# EAGLE design Soccer_Robot V1.1L (EAGLE 9.5.1)
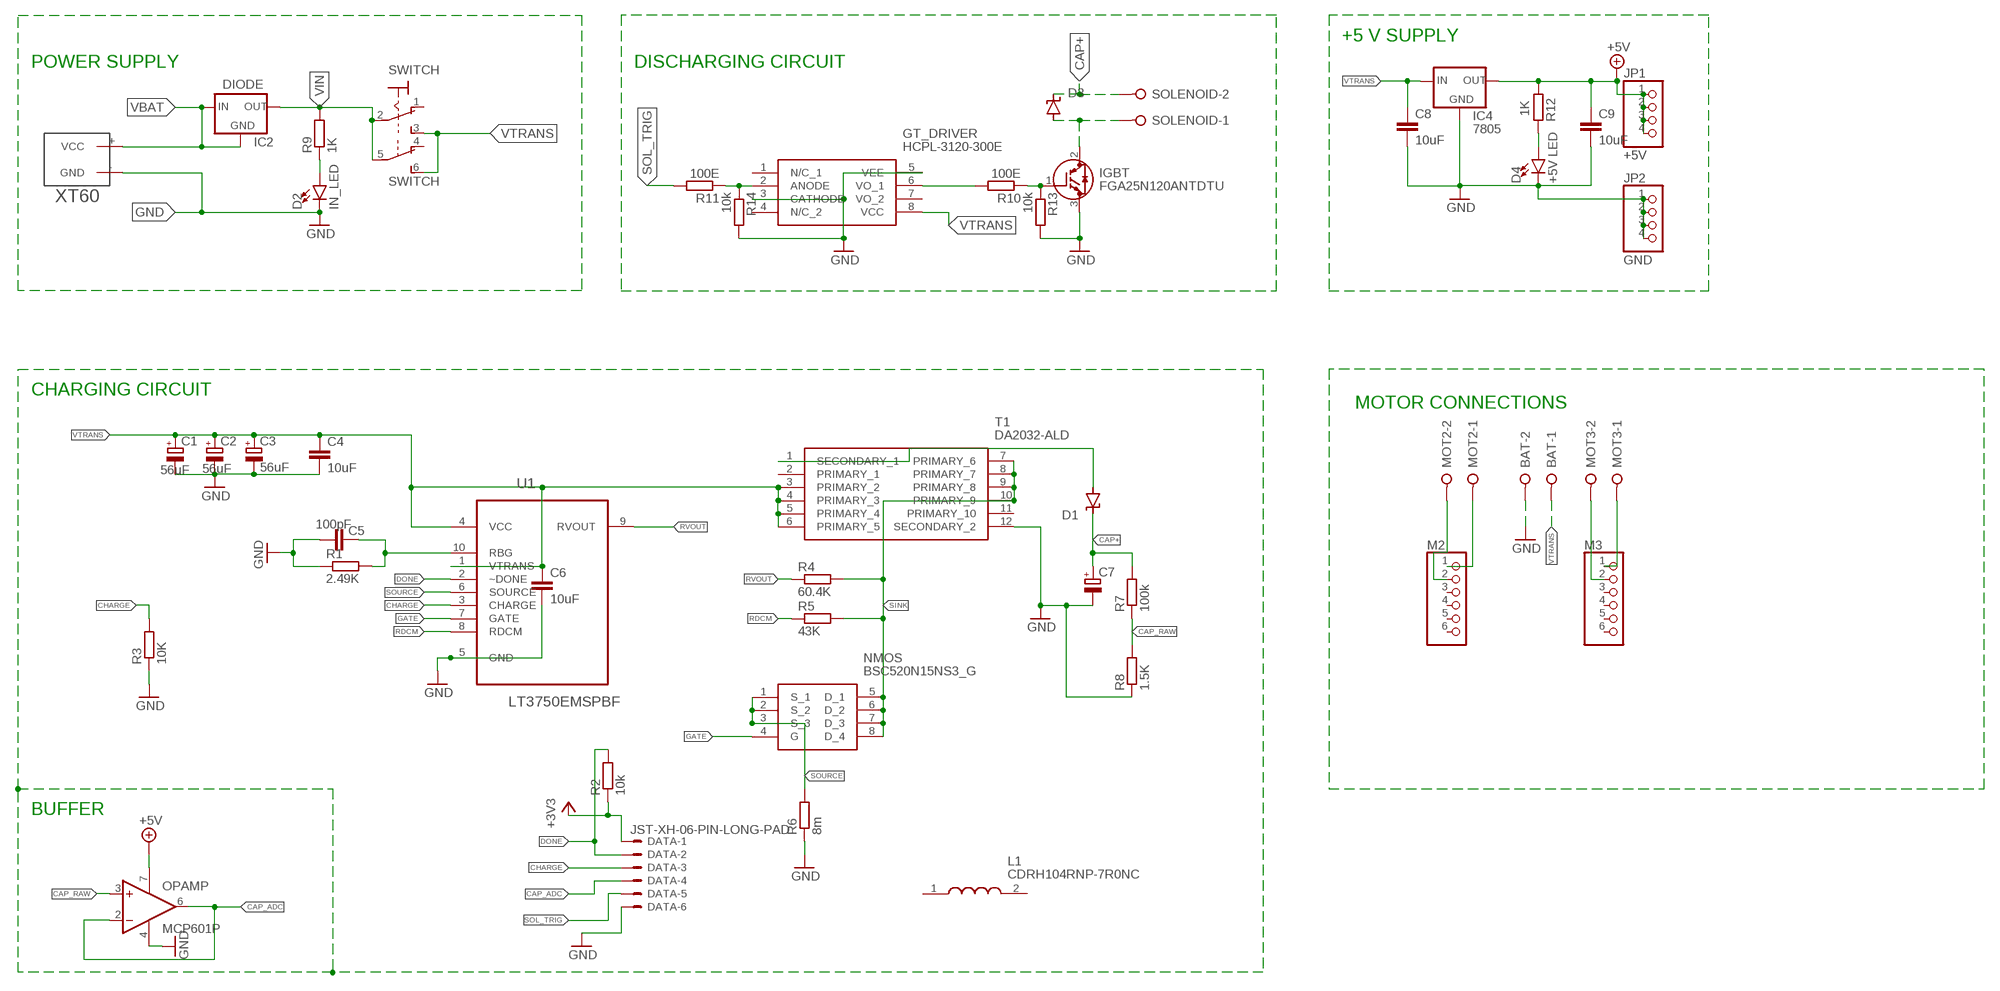
[diagram p0: schematic, sheet 1]

## Parts
BAT  W237-02P  [W237-132]
C1  56uF  CPOL-EUE2.5-5  [E2,5-5]
C2  56uF  CPOL-EUE2.5-5  [E2,5-5]
C3  56uF  CPOL-EUE2.5-5  [E2,5-5]
C4  10uF  C-EUC1206  [C1206]
C5  100pF  C-EUC1206  [C1206]
C6  10uF  C-EUC1206  [C1206]
C7  CPOL-EUE10-30  [EB30D]
C8  10uF  C-EUC1206  [C1206]
C9  10uF  C-EUC1206  [C1206]
D1  SUPPRESSOR-SMBG  [SMBG]
D2  IN_LED  LED5MM  [LED_5MM]
D3  SUPPRESSOR-SMBG  [SMBG]
D4  +5V LED  LED5MM  [LED_5MM]
DATA  JST-XH-06-PIN-LONG-PAD  [JST-XH-06-PACKAGE-LONG-PAD]
GT_DRIVER  HCPL-3120-300E  [HCPL-3120-GULL-WING]
IC2  DIODE  LM1117TO252  [TO252]
IC4  7805  78XXS  [78XXS]
IGBT  FGA25N120ANTDTU  [TO545P500X1560X2420-3P]
JP1  +5V  PINHD-1X4  [1X04]
JP2  GND  PINHD-1X4  [1X04]
L1  CDRH104RNP-7R0NC  [CDRH104RNP7R0NC]
M2  PINHD-1X6  [1X06]
M3  PINHD-1X6  [1X06]
MOT2  W237-02P  [W237-132]
MOT3  W237-02P  [W237-132]
NMOS  BSC520N15NS3_G  [PG-TDSON-8]
OPAMP  MCP601P  [DIL08]
R1  2.49K  R-EU_M1206  [M1206]
R2  10k  R-EU_M1206  [M1206]
R3  10K  R-EU_M1206  [M1206]
R4  60.4K  R-EU_M1206  [M1206]
R5  43K  R-EU_M1206  [M1206]
R6  8m  R-EU_M1206  [M1206]
R7  100k  R-EU_0207/10  [0207/10]
R8  1.5K  R-EU_0207/10  [0207/10]
R9  1K  R-EU_M1206  [M1206]
R10  100E  R-EU_M1206  [M1206]
R11  100E  R-EU_M1206  [M1206]
R12  1K  R-EU_M1206  [M1206]
R13  10k  R-EU_M1206  [M1206]
R14  10k  R-EU_M1206  [M1206]
SOLENOID  W237-02P  [W237-132]
SWITCH  320-938  [320-938]
T1  DA2032-ALD  [SOP250P2197X889-12N]
U1  LT3750EMSPBF  [SOP50P490X110-10N]
U$1  XT60  [XT60]

## Nets
+3V3: DATA.1 R2.1
+5V: C9.1 IC4.OUT JP1.1 JP1.2 JP1.3 JP1.4 OPAMP.7(V+) R12.1
CAP+: C7.+ D1.C D3.C R7.2 SOLENOID.2
CAP_ADC: DATA.4 OPAMP.2(-IN) OPAMP.6(OUT)
CAP_RAW: OPAMP.3(+IN) R7.1 R8.2
CHARGE: DATA.3 R3.2 U1.3(CHARGE)
DONE: DATA.2 R2.2 U1.2(~DONE)
GATE: NMOS.4(G) U1.7(GATE)
GND: BAT.2 C1.- C2.- C3.- C4.2 C5.2 C6.2 C7.- C8.2 C9.2 D2.K(C) D4.K(C) DATA.6 GT_DRIVER.3(CATHODE) GT_DRIVER.5(VEE) IC4.GND IGBT.3(E) JP2.1 JP2.2 JP2.3 JP2.4 OPAMP.4(V-) R1.1 R3.1 R6.1 R8.1 R13.2 R14.2 T1.12(SECONDARY_2) U1.5(GND) U$1.-(GND)
N$2: C5.1 R1.2 U1.10(RBG)
N$4: D1.A T1.1(SECONDARY_1)
N$7: D2.A R9.1
N$8: IGBT.1(G) R10.1 R13.1
N$9: GT_DRIVER.6(VO_1) R10.2
N$10: D3.A IGBT.2(C) SOLENOID.1
N$11: GT_DRIVER.2(ANODE) R11.1 R14.1
N$13: M3.1 MOT3.1
N$14: D4.A R12.2
N$15: M3.2 MOT3.2
N$16: M2.2 MOT2.2
N$17: M2.1 MOT2.1
RDCM: R5.1 U1.8(RDCM)
RVOUT: R4.1 U1.9(RVOUT)
SINK: NMOS.5(D_1) NMOS.6(D_2) NMOS.7(D_3) NMOS.8(D_4) R4.2 R5.2 T1.7(PRIMARY_6) T1.8(PRIMARY_7) T1.9(PRIMARY_8) T1.10(PRIMARY_9)
SOL_TRIG: DATA.5 R11.2
SOURCE: NMOS.1(S_1) NMOS.2(S_2) NMOS.3(S_3) R6.2 U1.6(SOURCE)
VBAT: IC2.1(GND) IC2.2(IN) U$1.+(VCC)
VIN: IC2.3(OUT) R9.2 SWITCH.2(1:P) SWITCH.5(B:P)
VTRANS: BAT.1 C1.+ C2.+ C3.+ C4.1 C6.1 C8.1 GT_DRIVER.8(VCC) IC4.IN SWITCH.3(1:S) SWITCH.6(B:S) T1.3(PRIMARY_2) T1.4(PRIMARY_3) T1.5(PRIMARY_4) T1.6(PRIMARY_5) U1.1(VTRANS) U1.4(VCC)
Unconnected: GT_DRIVER.1(N/C_1) GT_DRIVER.4(N/C_2) GT_DRIVER.7(VO_2) L1.1 L1.2 M2.3 M2.4 M2.5 M2.6 M3.3 M3.4 M3.5 M3.6 SWITCH.1(1:O) SWITCH.4(B:O) T1.2(PRIMARY_1) T1.11(PRIMARY_10)

## Notes on the sheet
- +5 V SUPPLY
- POWER SUPPLY | DISCHARGING CIRCUIT
- CHARGING CIRCUIT
- MOTOR CONNECTIONS
- BUFFER

## Library data of the parts
BAT MOT2 MOT3 SOLENOID = con-wago-508:W237-02P: WAGO SREW CLAMP; OC_FARNELL: unknown; OC_NEWARK: unknown
C1-C3 C7 = rcl:CPOL-EU: POLARIZED CAPACITOR, European symbol; SPICEPREFIX: C
C4-C6 C8 C9 = rcl:C-EU: CAPACITOR, European symbol; SPICEPREFIX: C
D1 D3 = diode:SUPPRESSOR-: Suppressor diode
D2 D4 = SparkFun-LED:LED: LED (Generic) Standard schematic elements and footprints for 5mm, 3mm, 1206, and 0603 sized LEDs. Generic LEDs with no color specified.
DATA = Rembrandt Electronics - JST XH Connectors v1-0:JST-XH-06-PIN: JST XH Connector 2 Pin Wire to board connector. Pitch: 2,54 mm, (0.100") Number of pins: 6 Created by Rembrandt Electronics www.rembrandtelectronics.com
GT_DRIVER = HCPL-3120-300E:HCPL-3120-300E: Logic Output Optocouplers 2.0A IGBT Gate Drive Source: Datasheet; DESCRIPTION: Logic Output Optocouplers 2.0A IGBT Gate Drive; HEIGHT: mm; MANUFACTURER_NAME: Avago Technologies; MANUFACTURER_PART_NUMBER: HCPL-3120-300E; MOUSER_PART_NUMBER: 630-HCPL-3120-300E; MOUSER_PRICE-STOCK: https://www.mouser.com/Search/Refine.aspx?Keyword=630-HCPL-3120-300E
IC2 = v-reg-2:LM1117
IC4 = v-reg-2:78XXS: VOLTAGE REGULATOR
IGBT = FGA25N120ANTDTU:FGA25N120ANTDTU: IGBT N-Ch 1200V 50A NPT Trench TO3PN Fairchild FGA25N120ANTDTU, 50 A 1200 V, 1MHz, 3-Pin TO-3P Source: Datasheet <https://componentsearchengine.com/Datasheets/1/FGA25N120ANTDTU.pdf>; DESCRIPTION: IGBT N-Ch 1200V 50A NPT Trench TO3PN Fairchild FGA25N120ANTDTU, 50 A 1200 V, 1MHz, 3-Pin TO-3P; HEIGHT: 5mm; MANUFACTURER_NAME: ON Semiconductor; MANUFACTURER_PART_NUMBER: FGA25N120ANTDTU; MOUSER_PART_NUMBER: 512-FGA25N120ANTDTU; MOUSER_PRICE-STOCK: https://www.mouser.com/Search/Refine.aspx?Keyword=512-FGA25N120ANTDTU
JP1 JP2 = pinhead:PINHD-1X4: PIN HEADER
L1 = CDRH104RNP-7R0NC:CDRH104RNP-7R0NC: Fixed Inductors 7uH 4.5A Source: Datasheet <https://www.arrow.com/en/products/cdrh104rnp-7r0nc/sumida>; DESCRIPTION: Fixed Inductors 7uH 4.5A; HEIGHT: 4mm; MANUFACTURER_NAME: Sumida; MANUFACTURER_PART_NUMBER: CDRH104RNP-7R0NC; MOUSER_PART_NUMBER: 851-CDRH104RNP-7R0NC; MOUSER_PRICE-STOCK: https://www.mouser.com/Search/Refine.aspx?Keyword=851-CDRH104RNP-7R0NC
M2 M3 = pinhead:PINHD-1X6: PIN HEADER
NMOS = BSC520N15NS3_G:BSC520N15NS3_G: MOSFET N-Ch 150V 21A TDSON-8 OptiMOS 3 Source: Datasheet <https://componentsearchengine.com/Datasheets/1/BSC520N15NS3 G.pdf>; DESCRIPTION: MOSFET N-Ch 150V 21A TDSON-8 OptiMOS 3; HEIGHT: mm; MANUFACTURER_NAME: Infineon; MANUFACTURER_PART_NUMBER: BSC520N15NS3 G; MOUSER_PART_NUMBER: 726-BSC520N15NS3GXT; MOUSER_PRICE-STOCK: https://www.mouser.com/Search/Refine.aspx?Keyword=726-BSC520N15NS3GXT
OPAMP = linear:MCP601: Single Op Amp 2.7V to 6.0V Single Supply CMOS Source: http://ww1.microchip.com/downloads/en/DeviceDoc/21314g.pdf
R1-R14 = rcl:R-EU_: RESISTOR, European symbol; SPICEPREFIX: R
SWITCH = switch:320-938: TOGGLE SWITCH distributor RS Components
T1 = DA2032ALD:DA2032-ALD: COILCRAFT - DA2032-ALD - TRANSFORMER, FLYBACK, LT3750, SMD Source: Datasheet <https://componentsearchengine.com/Datasheets/1/DA2032-ALD.pdf>; DESCRIPTION: COILCRAFT - DA2032-ALD - TRANSFORMER, FLYBACK, LT3750, SMD; HEIGHT: 8.89mm; MANUFACTURER_NAME: COILCRAFT; MANUFACTURER_PART_NUMBER: DA2032-ALD; MOUSER_PART_NUMBER: 994-DA2032-ALD; MOUSER_PRICE-STOCK: https://www.mouser.com/Search/Refine.aspx?Keyword=994-DA2032-ALD
U1 = LT3750-element14:LT3750EMSPBF: Capacitor Charger Controller; MPN: LT3750EMS#PBF; OC_FARNELL: 1273500; OC_NEWARK: 57M8591; PACKAGE: MSOP-10; SUPPLIER: Linear Technology
U$1 = XT60:XT60: XT60

## Board
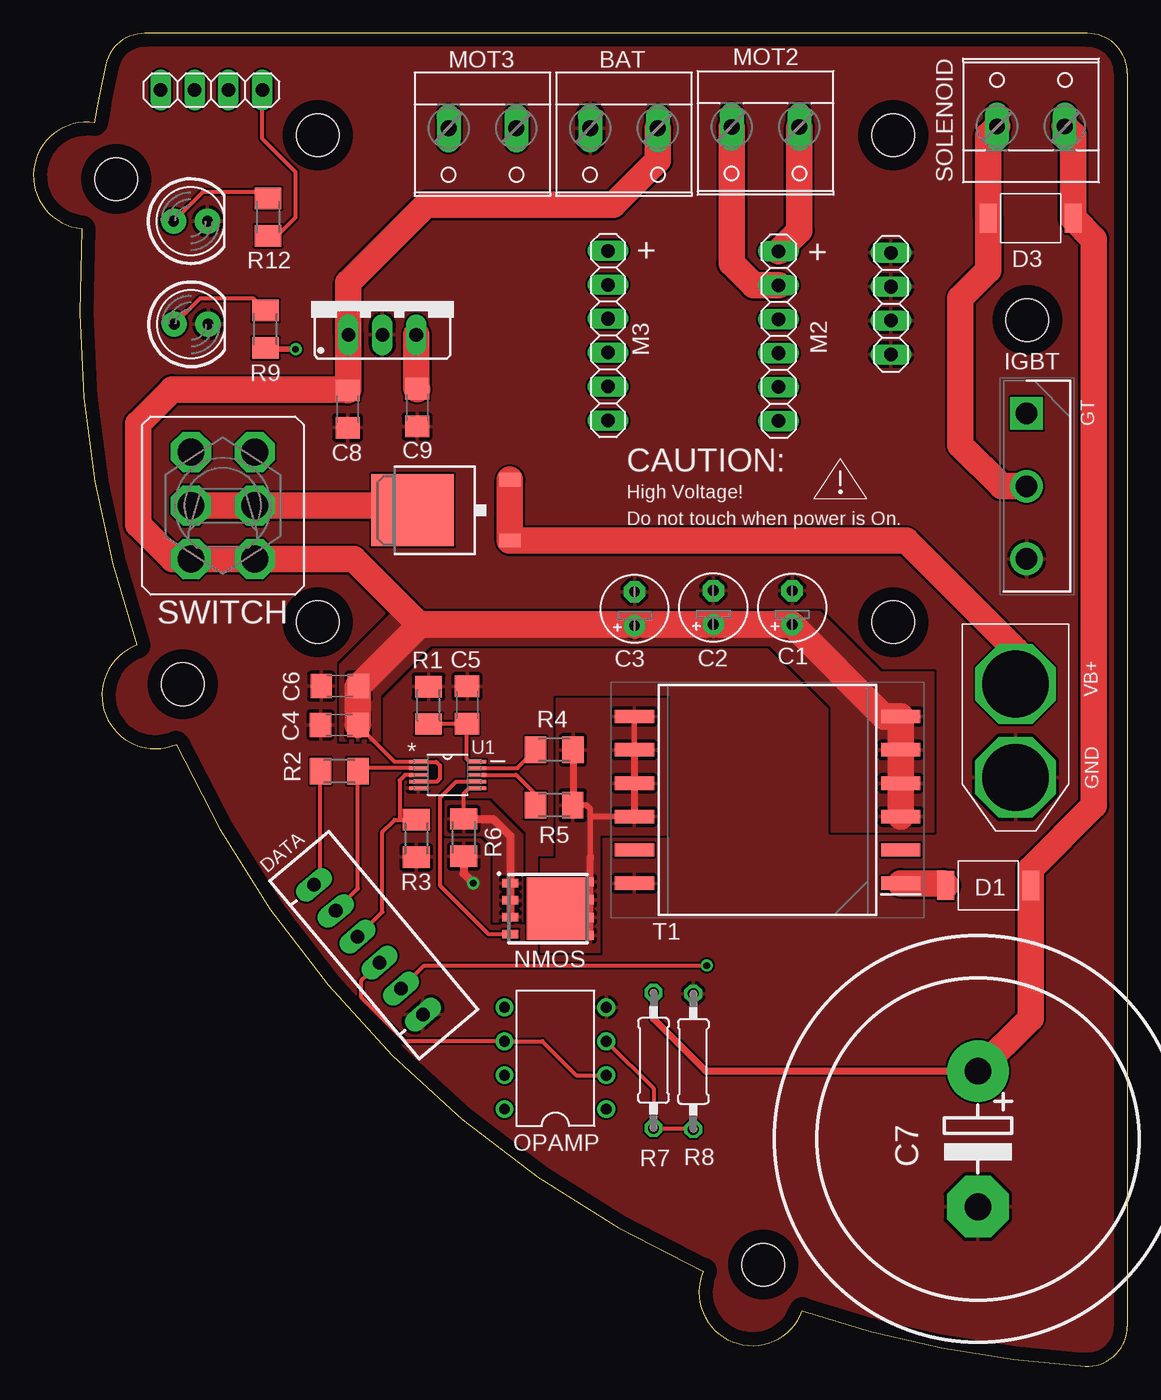
[diagram p1: board, top side]
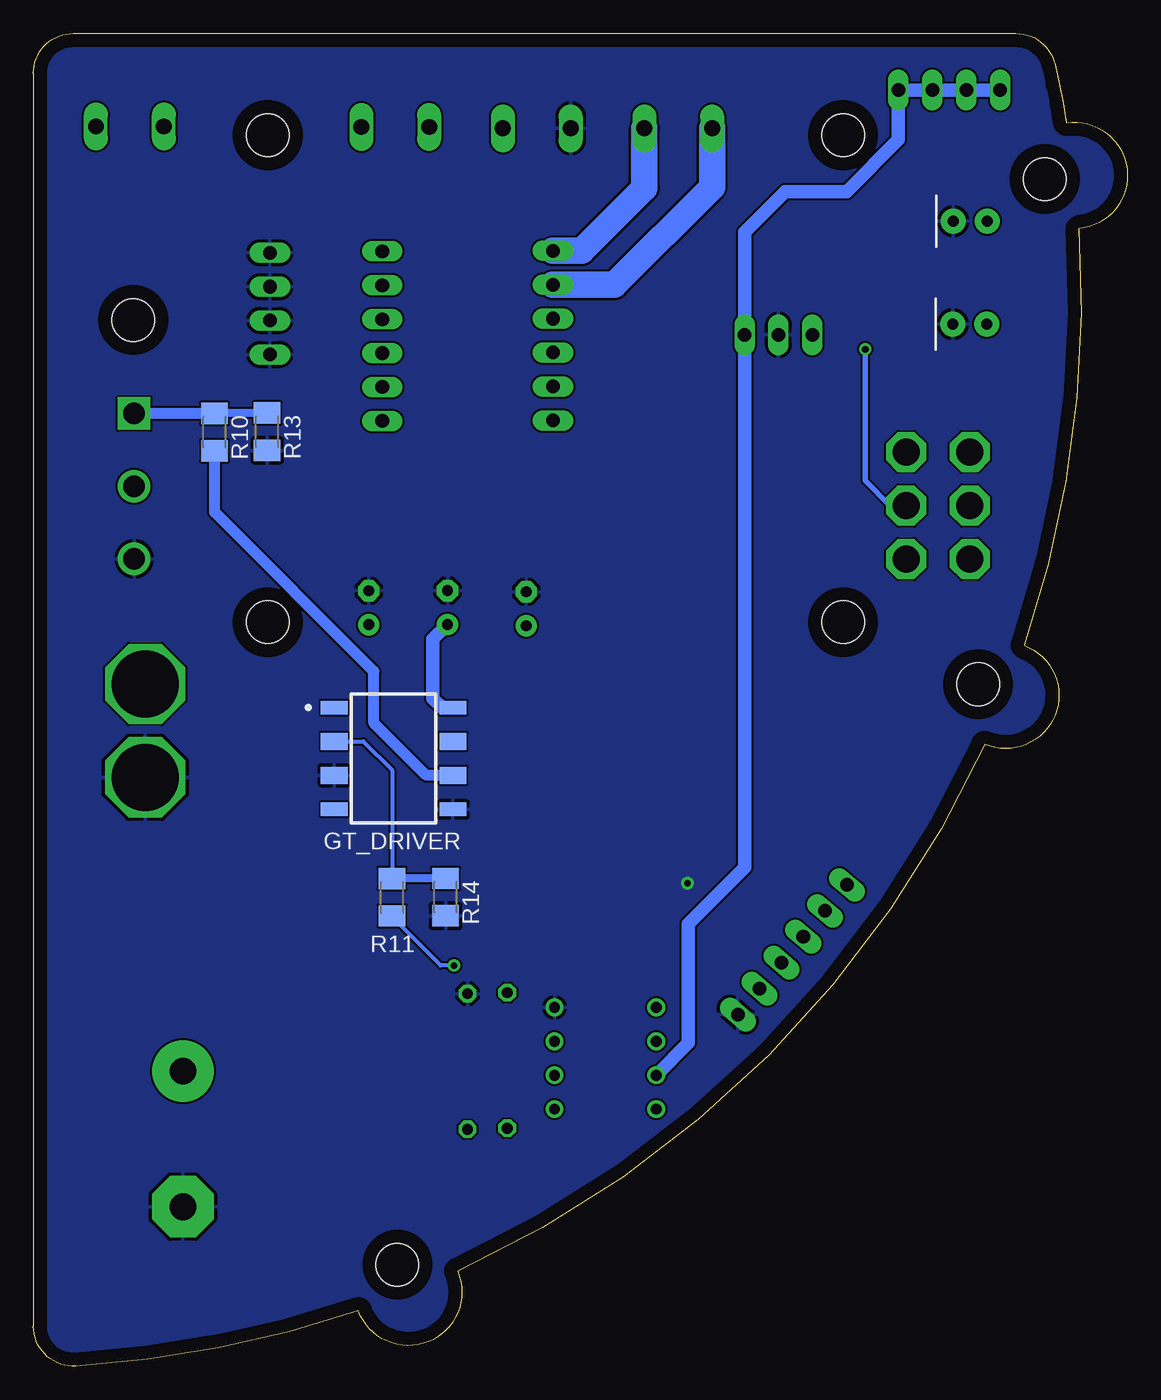
[diagram p2: board, bottom side, seen from below]

Size 81.95 x 99.87 mm. Coordinates in mm from the lower left corner, seen from the top.
Outline: 5.43,97.53 arc3 4.57,93.17 arc183 3.63,85.23 arc23 7.75,54.02 arc183 10.7,46.59 arc41 50.18,7.11 arc183 57.61,4.16 arc15 78.78,0 arc93 81.95,3
Outline: 5.43,97.53 arc-77 8.35,99.87 78.95,99.87 arc-90 81.95,96.87 81.95,4
Outline: 81.95,4.01 81.95,2.98
Copper layers (1*16): Top 0.035mm / dielectric 1.5mm / Bottom 0.035mm
Design rules "default": minimum track width 6mil, minimum drill 0.35mm, track to track 6mil, track to pad 6mil, pad to pad 6mil, via to via 6mil, smd to smd 6mil, copper to edge 40mil, drill to drill 6mil, minimum pad ring 10mil, minimum via ring 8mil, stop-mask expansion 4mil, vias tented up to drill 0mil, thermal gap 10mil
Holes 3.2 mm at 6.21,88.96 54.68,7.61 11.19,51.1 64.4,55.74 74.46,78.39 21.3,92.24 64.4,92.24 21.3,55.74

### Footprints (pad centres in the part's own frame; a part is rotated, then mirrored left to right if it is on the bottom)
W237-132 = drill 1.194 long: 1 -2.54,-0.635; 2 2.54,-0.635
E2,5-5 = drill 0.813 pad 1.6: + -1.27,0 | drill 0.813 pad 1.6 octagon: - 1.27,0
C1206 = smd 1.6 x 1.8: 1 -1.4,0; 2 1.4,0
EB30D = drill 2.007 pad 4.597: + -5.08,0 | drill 2.007 pad 4.597 octagon: - 5.08,0
SMBG = smd 1.27 x 2.16: A 3.17,0; C -3.17,0
LED_5MM = drill 0.813 pad 1.88: A -1.27,0; K 1.27,0
JST-XH-06-PACKAGE-LONG-PAD = drill 1.016 long: 1 -6.35,0; 2 -3.81,0; 3 -1.27,0; 4 1.27,0; 5 3.81,0; 6 6.35,0
HCPL-3120-GULL-WING = smd 1.016 x 2: 1 -3.81,-4.45; 4 3.81,-4.45; 5 3.81,4.45; 8 -3.81,4.45 | smd 1.27 x 2: 2 -1.27,-4.45; 3 1.27,-4.45; 6 1.27,4.45; 7 -1.27,4.45
TO252 = smd 1 x 1.6: 1 -2.28,-6.07; 2 2.28,-6.07 | smd 5.4 x 6.2: 3 0,1.23
78XXS = drill 1.016 long: GND 0,-2.54; IN -2.54,-2.54; OUT 2.54,-2.54
TO545P500X1560X2420-3P = drill 1.62 pad 2.43 square: 1 0,0 | drill 1.62 pad 2.43: 2 5.45,0; 3 10.9,0
1X04 = drill 1.016 long: 1 -3.81,0; 2 -1.27,0; 3 1.27,0; 4 3.81,0
CDRH104RNP7R0NC = smd 3.2 x 1.6: 1 0,-4.45; 2 0,4.45
1X06 = drill 1.016 long: 1 -6.35,0; 2 -3.81,0; 3 -1.27,0; 4 1.27,0; 5 3.81,0; 6 6.35,0
PG-TDSON-8 = smd 0.65 x 1.2: 1 -1.905,-6; 2 -0.635,-6; 3 0.635,-6; 4 1.905,-6 | smd 0.7 x 0.5: 5 2,0; 6 0.665,0; 7 -0.665,0; 8 -2,0 | smd 4.7 x 4.5: 9 0,-2.5
DIL08 = drill 0.813 pad 1.27: 1 -3.81,-3.81; 2 -1.27,-3.81; 3 1.27,-3.81; 4 3.81,-3.81; 5 3.81,3.81; 6 1.27,3.81; 7 -1.27,3.81; 8 -3.81,3.81
M1206 = smd 1.6 x 2: 1 -1.4,0; 2 1.4,0
0207/10 = drill 0.813 octagon: 1 -5.08,0; 2 5.08,0
320-938 = drill 2.007 octagon: 1 -2.388,4.013; 2 -2.388,0; 3 -2.388,-4.013; 4 2.388,4.013; 5 2.388,0; 6 2.388,-4.013
SOP250P2197X889-12N = smd 2.95 x 1: 1 -9.975,6.25; 2 -9.975,3.75; 3 -9.975,1.25; 4 -9.975,-1.25; 5 -9.975,-3.75; 6 -9.975,-6.25; 7 9.975,-6.25; 8 9.975,-3.75; 9 9.975,-1.25; 10 9.975,1.25; 11 9.975,3.75; 12 9.975,6.25
SOP50P490X110-10N = smd 1.397 x 0.279: 1 -2.184,0.991; 2 -2.184,0.508; 3 -2.184,0; 4 -2.184,-0.508; 5 -2.184,-0.991; 6 2.184,-0.991; 7 2.184,-0.508; 8 2.184,0; 9 2.184,0.508; 10 2.184,0.991
XT60 = drill 5 octagon: + 4.5,0; - 11.5,0

### Placement (x,y rotation side)
BAT  44.24,92.12 180 top
C1  56.83,56.83 90 top
C2  50.93,56.84 90 top
C3  45.03,56.75 90 top
C4  22.91,48.06 180 top
C5  32.48,49.54 90 top
C6  22.96,50.96 180 top
C7  70.75,17.03 270 top
C8  23.54,71.72 270 top
C9  28.74,71.82 270 top
D1  71.52,36.02 180 top
D2  11.81,78.07 0 top
D3  74.71,86.02 180 top
D4  11.77,85.8 0 top
DATA  25.1,31.21 310 top
GT_DRIVER  54.97,45.54 270 bottom
IC2  29.62,64.14 90 top
IC4  26.14,79.82 0 top
IGBT  74.4,71.39 270 top
JP1  13.34,95.62 180 top
JP2  64.24,79.62 90 top
L1  -10.56,5.02 0 top  (outside the outline)
M2  55.82,77.18 270 top
M3  43.04,77.22 270 top
MOT2  54.84,92.22 180 top
MOT3  33.64,92.12 180 top
NMOS  41.72,34.28 270 top
OPAMP  39.1,23.07 90 top
R1  29.6,49.52 270 top
R2  22.91,44.57 0 top
R3  28.68,39.54 90 top
R4  39.02,46.18 0 top
R5  39,42.03 0 top
R6  32.23,39.6 90 top
R7  46.45,22.91 90 top
R8  49.43,22.83 270 top
R9  17.38,77.7 270 top
R10  68.38,69.99 270 bottom
R11  55.08,35.14 270 bottom
R12  17.57,86.1 90 top
R13  64.44,70.02 270 bottom
R14  51.08,35.15 270 bottom
SOLENOID  74.72,93.53 0 top
SWITCH  14.19,64.49 0 top
T1  54.99,42.43 180 top
U1  31.02,44.3 0 top
U$1  73.57,55.62 270 top

### Tracks (layer width: path | path; a pad name or v marks a point on that pad's centre or on a via)
+3V3
  Top 0.305: R2.1 21.44,44.5 21.44,36.49 DATA.1
+5V
  Top 0.305: R12.1 18.26,84.7 19.64,86.08 19.64,89.47 17.15,91.96 JP1.1
  Top 0.508: 17.59,84.72 R12.1
  Top 2: IC4.OUT 28.68,73.28 C9.1
  Bottom 0.508: IC4.OUT 28.68,79.78
  Bottom 1.016: JP1.4 JP1.3 JP1.2 JP1.1 17.15,91.91 21.04,88.02 25.63,88.02 28.68,84.97 IC4.OUT 28.68,49.24 28.68,49.23 28.68,37.35 32.88,33.15 32.88,24.21 OPAMP.7
CAP+
  Top 0.508: R7.2 46.45,26.01 50.35,22.11 C7.+
  Top 2: C7.+ 74.69,26.05 D1.C 74.69,37.27 79.44,42.02 79.44,84.46 D3.C 77.88,92.27 SOLENOID.2
CAP_ADC
  Top 0.305: OPAMP.2 40.66,21.8 38.12,24.34 OPAMP.6 27.87,24.34 24.58,27.63 24.58,28.89 25.03,29.35 25.57,29.89 DATA.4
CAP_RAW
  Top 0.305: OPAMP.3 46.45,20.8 R7.1 49.35,17.83 R8.2
CHARGE
  Top 0.305: 27.44,40.94 R3.2 | U1.3 27.85,44.3 27.44,43.89 27.44,40.94 | 27.44,40.94 27.05,40.94 26.14,40.02 26.14,34.03 DATA.3
DONE
  Top 0.152: 28.79,44.86 U1.2
  Top 0.305: U1.2 24.54,44.81 R2.2 24.31,35.78 DATA.2
GATE
  Top 0.305: U1.7 31.64,43.79 30.44,42.59 30.44,36.02 34.09,32.37 NMOS.4
GND  (via drill 0.5)
  Top 0.61: R6.1 32.23,36.91 v32.95,36.19
  pour Bottom (rank 4): -1.56,103.02 -1.56,-0.98 92.44,-0.98 92.44,103.02
  pour Top (rank 4): -3.56,-1.98 87.44,-1.98 87.44,101.02 -3.56,101.02
N$2
  Top 0.305: U1.10 32.66,45.29 32.45,45.5 32.45,48.11 C5.1 32.46,48.12 R1.2
N$4
  Top 2: T1.1 68.19,36.18 D1.A
N$7
  Top 0.305: D2.A 12.49,80.02 16.46,80.02 R9.1
N$8
  Bottom 0.61: R13.1 68.35,71.42 R10.1
  Bottom 0.813: R10.1 IGBT.1
N$9
  Bottom 0.813: GT_DRIVER.6 52.52,44.27 56.44,48.19 56.44,52.06 68.38,64 R10.2
N$10
  Top 2: SOLENOID.1 71.54,92.25 D3.A 71.54,82.12 69.44,80.02 69.44,69.02 72.52,65.94 IGBT.2
N$11
  Bottom 0.305: GT_DRIVER.2 57.23,46.81 55.08,44.66 55.08,37.02 R11.1
  Bottom 0.61: R14.1 54.61,36.55 55.08,37.02
N$13
  Bottom 2: M3.1 40.89,83.57 36.18,88.28 MOT3.1
N$14
  Top 0.305: D4.A 12.72,88.02 17.44,88.02 17.57,87.89 R12.2
N$15
  Bottom 2: MOT3.2 31.1,88.36 38.43,81.03 M3.2
N$16
  Top 2: MOT2.2 52.3,82.64 53.95,80.99 M2.2
N$17
  Top 2: M2.1 57.38,85.09 MOT2.1
RDCM
  Top 0.305: U1.8 36.16,44.3 37.6,42.86 R5.1
RVOUT
  Top 0.305: U1.9 36.25,44.81 R4.1
SINK
  Top 0.406: 41.72,38.02 41.72,41.18 | 41.72,41.18 41.72,41.74 41.41,42.05 40.42,42.05 | T1.10 41.72,41.18 | T1.8 T1.7
  Top 0.508: NMOS.5 NMOS.6 NMOS.7 NMOS.8 41.72,38.02 41.72,38.2 | R4.2 40.42,42.05 R5.2 | T1.10 T1.9 T1.8
  pour Top: 39.15,50.02 39.15,38.02 38.02,38.02 38.02,31.02 42.44,31.02 42.44,39.8 47.44,39.8 47.44,50.02
SOL_TRIG  (via drill 0.5)
  Top 0.305: DATA.5 29.28,30.02 v50.44,30.02
  Bottom 0.305: v50.44,30.02 51.44,30.02 55.08,33.66 R11.2
SOURCE
  Top 0.305: R6.2 32.23,42.91 32.63,43.31 U1.6
  Top 0.61: R6.2 34.46,41 35.72,39.74 NMOS.1 NMOS.2 NMOS.3
  pour Top: 36.64,33.27 36.64,39.82 34.1,42.36 30.83,42.36 30.81,39.82 30.87,39.76 33.7,39.76 34.44,39.02 34.44,33.27
VBAT
  Top 2: IC2.2 IC2.1 65.37,61.86 73.57,53.66 U$1.+
VIN  (via drill 0.5)
  Top 0.406: v19.64,76.2 17.48,76.2 R9.2
  Top 2: SWITCH.2 SWITCH.5 28.04,64.49 IC2.3
  Bottom 0.406: SWITCH.5 17.79,64.49 19.64,66.34 v19.64,76.2
VTRANS
  Top 0.305: U1.4 30.21,43.79 30.44,44.02 30.44,45.02 30.17,45.29 U1.1 27.08,45.29 C4.1
  Top 2: T1.3 T1.4 T1.5 T1.6 63.71,48.68 C1.+ C2.+ 45.12,55.57 | 45.12,55.57 C3.+ | C4.1 24.31,50.91 C6.1 28.97,55.57 | 28.97,55.57 45.12,55.57 | 23.6,73.18 IC4.IN 23.6,81.18 29.44,87.02 43.44,87.02 46.78,90.36 BAT.1 | 23.6,73.18 C8.1 | 28.97,55.57 28.89,55.57 23.98,60.48 SWITCH.6 SWITCH.3 10.43,60.48 7.85,63.06 7.85,70.62 10.4,73.18 23.6,73.18
  Bottom 1.016: GT_DRIVER.8 51.34,49.35 52.03,50.04 52.03,54.47 C2.+
  pour Top: 22.94,52.52 22.94,46.85 25.98,46.85 25.98,50.26 29.72,54 55.19,54 59.76,49.43 59.76,40.02 67.44,40.02 67.44,52.02 63.44,52.02 58.91,56.55 26.97,56.55

### Text on the board
tNames: + | + | GT | CAUTION: | High Voltage! | Do not touch when power is On. | VB+ | GND